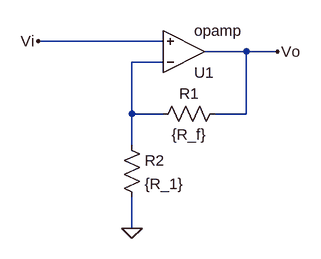
[diagram p0: schematic No_Inversor.asc]
No_Inversor.asc, the LTspice schematic file:
Version 4.1
SHEET 1 880 680
WIRE 128 80 -64 80
WIRE 256 96 192 96
WIRE 304 96 256 96
WIRE 128 112 80 112
WIRE 80 192 80 112
WIRE 128 192 80 192
WIRE 256 192 256 96
WIRE 256 192 208 192
WIRE 80 240 80 192
WIRE 80 368 80 320
FLAG 304 96 Vo
FLAG 80 368 0
FLAG -64 80 Vi
SYMBOL OpAmps\\opamp 160 160 M180
SYMATTR InstName U1
SYMBOL res 224 176 R90
WINDOW 0 0 56 VBottom 2
WINDOW 3 32 56 VTop 2
SYMATTR InstName R1
SYMATTR Value {R_f}
SYMBOL res 64 224 R0
SYMATTR InstName R2
SYMATTR Value {R_1}

The netlist it stands for:
* No_Inversor.asc
X§U1 N001 Vi Vo opamp Aol=100K GBW=10Meg  ; pins invin noninvin out
R1 Vo N001 {R_f}
R2 N001 0 {R_1}
.backanno
.end